# EAGLE design S77_Eggbot (EAGLE 7.7.0)
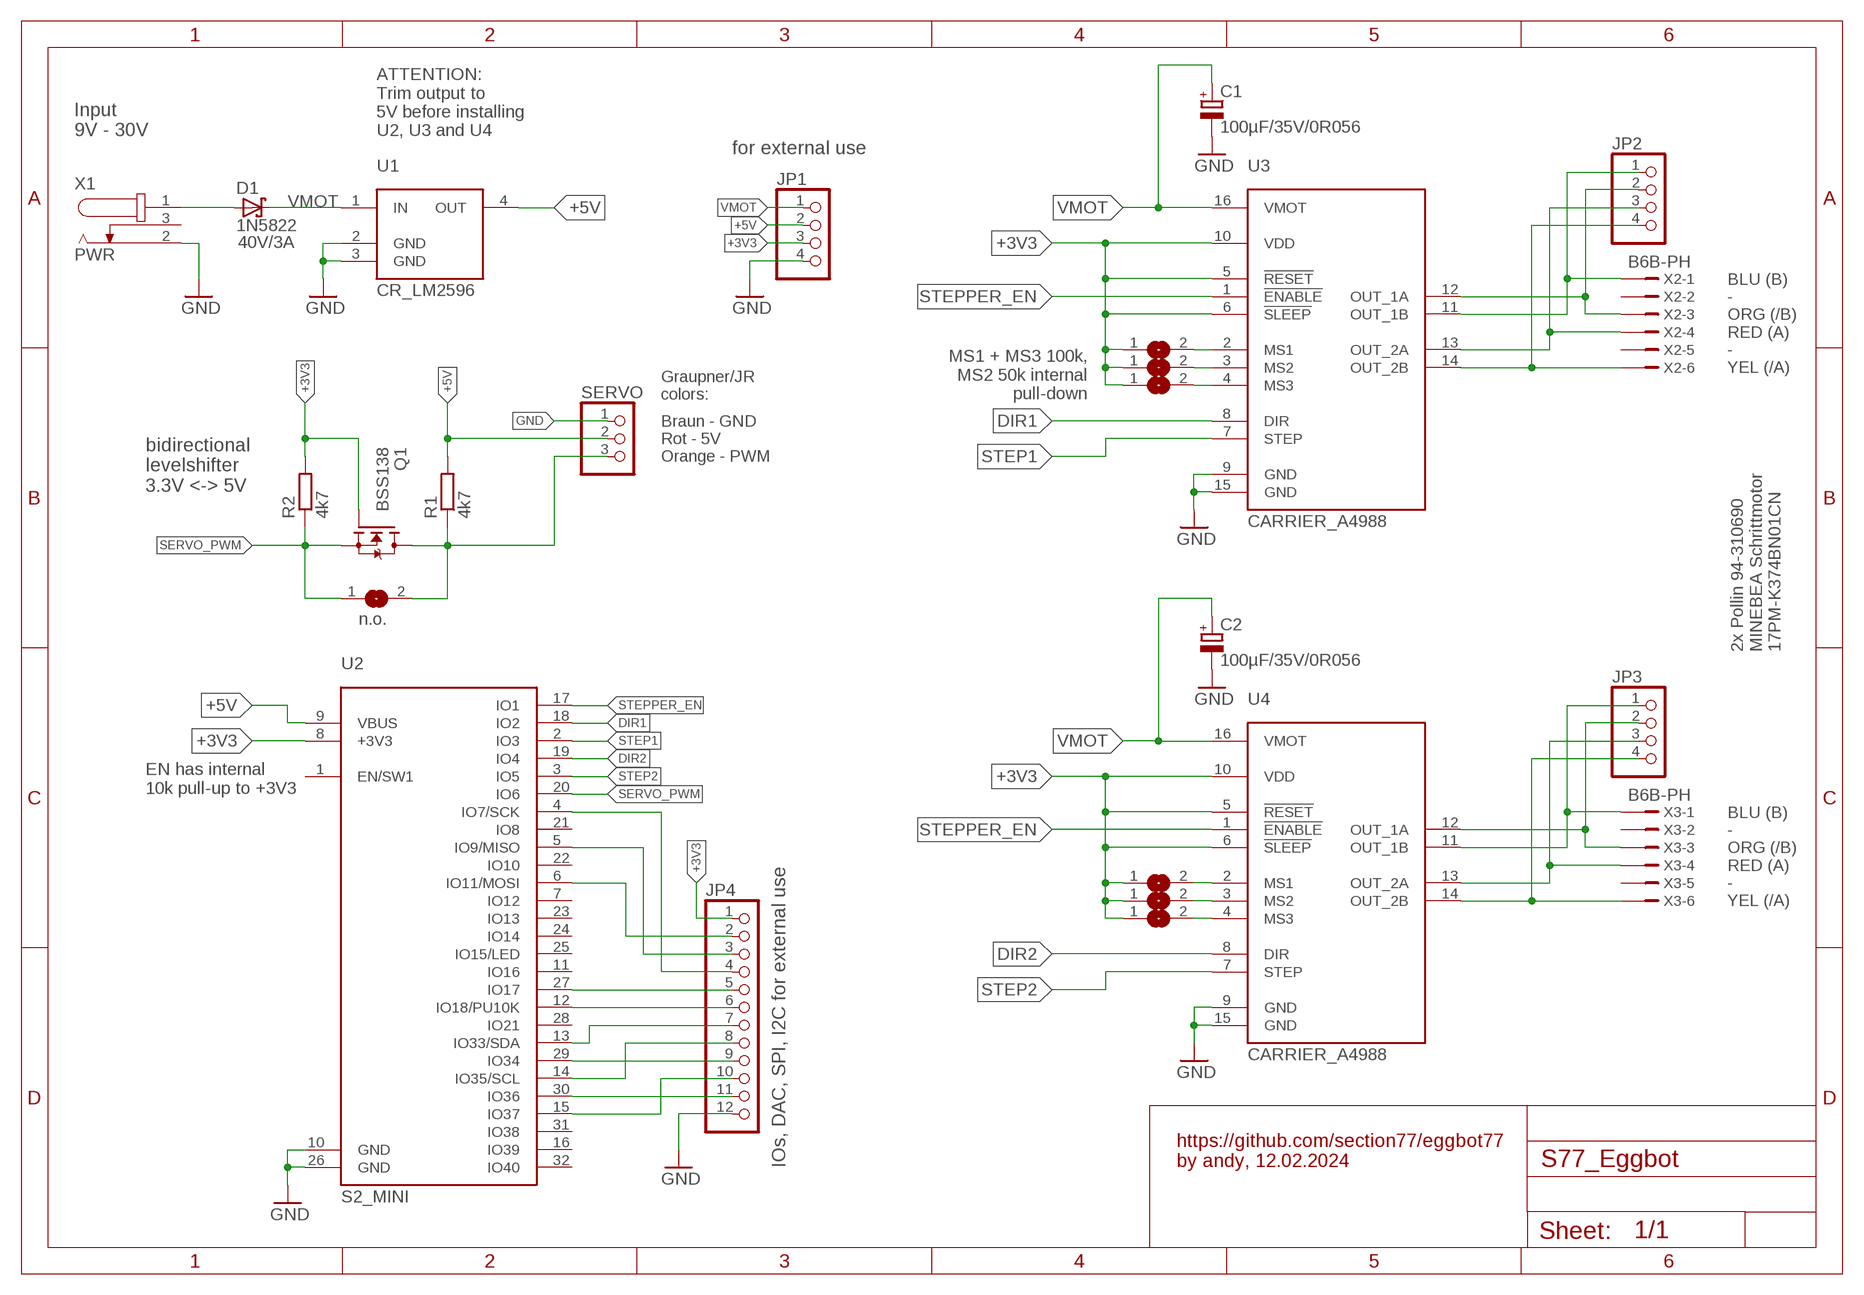
[diagram p0: schematic, sheet 1]

## Parts
C1  100µF/35V/0R056  CPOL-EUE3.5-8  [E3,5-8]
C2  100µF/35V/0R056  CPOL-EUE3.5-8  [E3,5-8]
D1  1N5822  [DO201T15]
JP1  PINHD-1X4  [1X04]
JP2  PINHD-1X4  [1X04]
JP3  PINHD-1X4  [1X04]
JP4  PINHD-1X12  [1X12]
Q1  BSS138  [SOT23]
R1  4k7  R-EU_R1206  [R1206]
R2  4k7  R-EU_R1206  [R1206]
SERVO  PINHD-1X3  [1X03]
SJ1  SJ  [SJ]
SJ2  SJ  [SJ]
SJ3  SJ  [SJ]
SJ4  SJ  [SJ]
SJ5  SJ  [SJ]
SJ6  SJ  [SJ]
SJ7  n.o.  SJ  [SJ]
U1  CR_LM2596  [CR_LM2596]
U2  S2_MINI  [S2_MINI]
U3  CARRIER_A4988  [CARRIER_A4988]
U4  CARRIER_A4988  [CARRIER_A4988]
X1  PWR  POLLIN_JACK_A  [POLLIN_JACK_A]
X2  B6B-PH  [B6B-PH]
X3  B6B-PH  [B6B-PH]

## Nets
+3V3: JP1.3 JP4.1 Q1.1(G) R2.2 SJ1.1 SJ2.1 SJ3.1 SJ4.1 SJ5.1 SJ6.1 U2.8(+3V3) U3.5(!RESET) U3.6(!SLEEP) U3.10(VDD) U4.5(!RESET) U4.6(!SLEEP) U4.10(VDD)
+5V: JP1.2 R1.2 SERVO.2 U1.4(OUT) U2.9(VBUS)
DIR1: U2.18(IO2) U3.8(DIR)
DIR2: U2.19(IO4) U4.8(DIR)
GND: C1.- C2.- JP1.4 JP4.12 SERVO.1 U1.2(GND) U1.3(GND) U2.10(GND) U2.26(GND) U3.9(GND) U3.15(GND) U4.9(GND) U4.15(GND) X1.2
N$1: Q1.3(D) R1.1 SERVO.3 SJ7.2
N$2: JP2.1 U3.11(OUT_1B) X2.1
N$3: D1.A X1.1
N$4: JP2.2 U3.12(OUT_1A) X2.3
N$5: JP2.3 U3.13(OUT_2A) X2.4
N$6: JP2.4 U3.14(OUT_2B) X2.6
N$7: JP3.1 U4.11(OUT_1B) X3.1
N$8: JP3.2 U4.12(OUT_1A) X3.3
N$9: JP3.3 U4.13(OUT_2A) X3.4
N$10: JP3.4 U4.14(OUT_2B) X3.6
N$11: SJ1.2 U3.2(MS1)
N$12: SJ2.2 U3.3(MS2)
N$13: SJ3.2 U3.4(MS3)
N$17: SJ4.2 U4.2(MS1)
N$18: SJ5.2 U4.3(MS2)
N$19: SJ6.2 U4.4(MS3)
N$20: JP4.4 U2.4(IO7/SCK)
N$21: JP4.3 U2.5(IO9/MISO)
N$22: JP4.2 U2.6(IO11/MOSI)
N$23: JP4.5 U2.27(IO17)
N$24: JP4.6 U2.12(IO18/PU10K)
N$25: JP4.7 U2.13(IO33/SDA)
N$26: JP4.9 U2.29(IO34)
N$27: JP4.8 U2.14(IO35/SCL)
N$28: JP4.11 U2.30(IO36)
N$29: JP4.10 U2.15(IO37)
SERVO_PWM: Q1.2(S) R2.1 SJ7.1 U2.20(IO6)
STEP1: U2.2(IO3) U3.7(STEP)
STEP2: U2.3(IO5) U4.7(STEP)
STEPPER_EN: U2.17(IO1) U3.1(!ENABLE) U4.1(!ENABLE)
VMOT: C1.+ C2.+ D1.C JP1.1 U1.1(IN) U3.16(VMOT) U4.16(VMOT)
Unconnected: U2.1(EN/SW1) U2.7(IO12) U2.11(IO16) U2.16(IO39) U2.21(IO8) U2.22(IO10) U2.23(IO13) U2.24(IO14) U2.25(IO15/LED) U2.28(IO21) U2.31(IO38) U2.32(IO40) X1.3 X2.2 X2.5 X3.2 X3.5

## Notes on the sheet
- Input
  9V - 30V
- ATTENTION:
  Trim output to
  5V before installing
  U2, U3 and U4
- for external use
- 40V/3A
- BLU (B)
  -
  ORG (/B)
  RED (A)
  -
  YEL (/A)
- MS1 + MS3 100k,
  MS2 50k internal
  pull-down
- Graupner/JR
  colors:
- Braun - GND
  Rot - 5V
  Orange - PWM
- bidirectional
  levelshifter
  3.3V <-> 5V
- 2x Pollin 94-310690
  MINEBEA Schrittmotor
  17PM-K374BN01CN
- EN has internal
  10k pull-up to +3V3
- BLU (B)
  -
  ORG (/B)
  RED (A)
  -
  YEL (/A)
- IOs, DAC, SPI, I2C for external use
- https://github.com/section77/eggbot77
  by andy, 12.02.2024

## Library data of the parts
C1 C2 = rcl:CPOL-EU: POLARIZED CAPACITOR, European symbol; MF: Panasonic; MPN: EEUFR1V101; OC_REICHELT: RAD FR 100/35
D1 = lib_s77_eggbot:1N5822; OC_REICHELT: 1N 5822
JP1-JP3 = pinhead:PINHD-1X4: PIN HEADER
JP4 = pinhead:PINHD-1X12: PIN HEADER
Q1 = bss138_10:BSS138: BSS138 N-Channel Logic Level Enhancement Mode Field Effect Transistor Source: http://www.fairchildsemi.com/datasheets/BS/BSS138.pdf; MF: Fairchild; MPN: BSS138; OC_FARNELL: 9845330; OC_NEWARK: 67R2009
R1 R2 = rcl:R-EU_: RESISTOR, European symbol
SERVO = pinhead:PINHD-1X3: PIN HEADER
SJ1-SJ7 = jumper:SJ: SMD solder JUMPER
U1 = lib_s77_eggbot:CR_LM2596: Zhovee ‎KKK20 board with LM2596 On Amazon: https://www.amazon.de/Stromversorgung-Spannungsregler-Abwärtswandler-Hocheffizienter-Einstellbares/dp/B07F38DJLS/
U2 = lib_s77_eggbot:S2_MINI: Based on https://www.wemos.cc/en/latest/_static/files/sch_s2_mini_v1.0.0.pdf and https://www.wemos.cc/en/latest/_static/boards/s2_mini_v1.0.0_2_16x16.jpg IO0 -> SW2 IO15 -> LED IO18->10k PullUp 3V3
U3 U4 = lib_s77_eggbot:CARRIER_A4988: A4988 carrier board based on Pololu #1182 drawings
X1 = lib_s77_eggbot:POLLIN_JACK_A: Quellen: Pollin 452 316 (5.5/2.1mm) <https://www.pollin.de/productdownloads/D452316D.PDF> Pollin 451 810 (5.5/2.5mm) <https://www.pollin.de/productdownloads/D451810D.PDF>
X2 X3 = lib_s77_eggbot:B6B-PH: JST B6B-PH

## Net classes
0 default: width 0.2 mm, drill 0.3 mm, clearance 0.15 mm

## Board
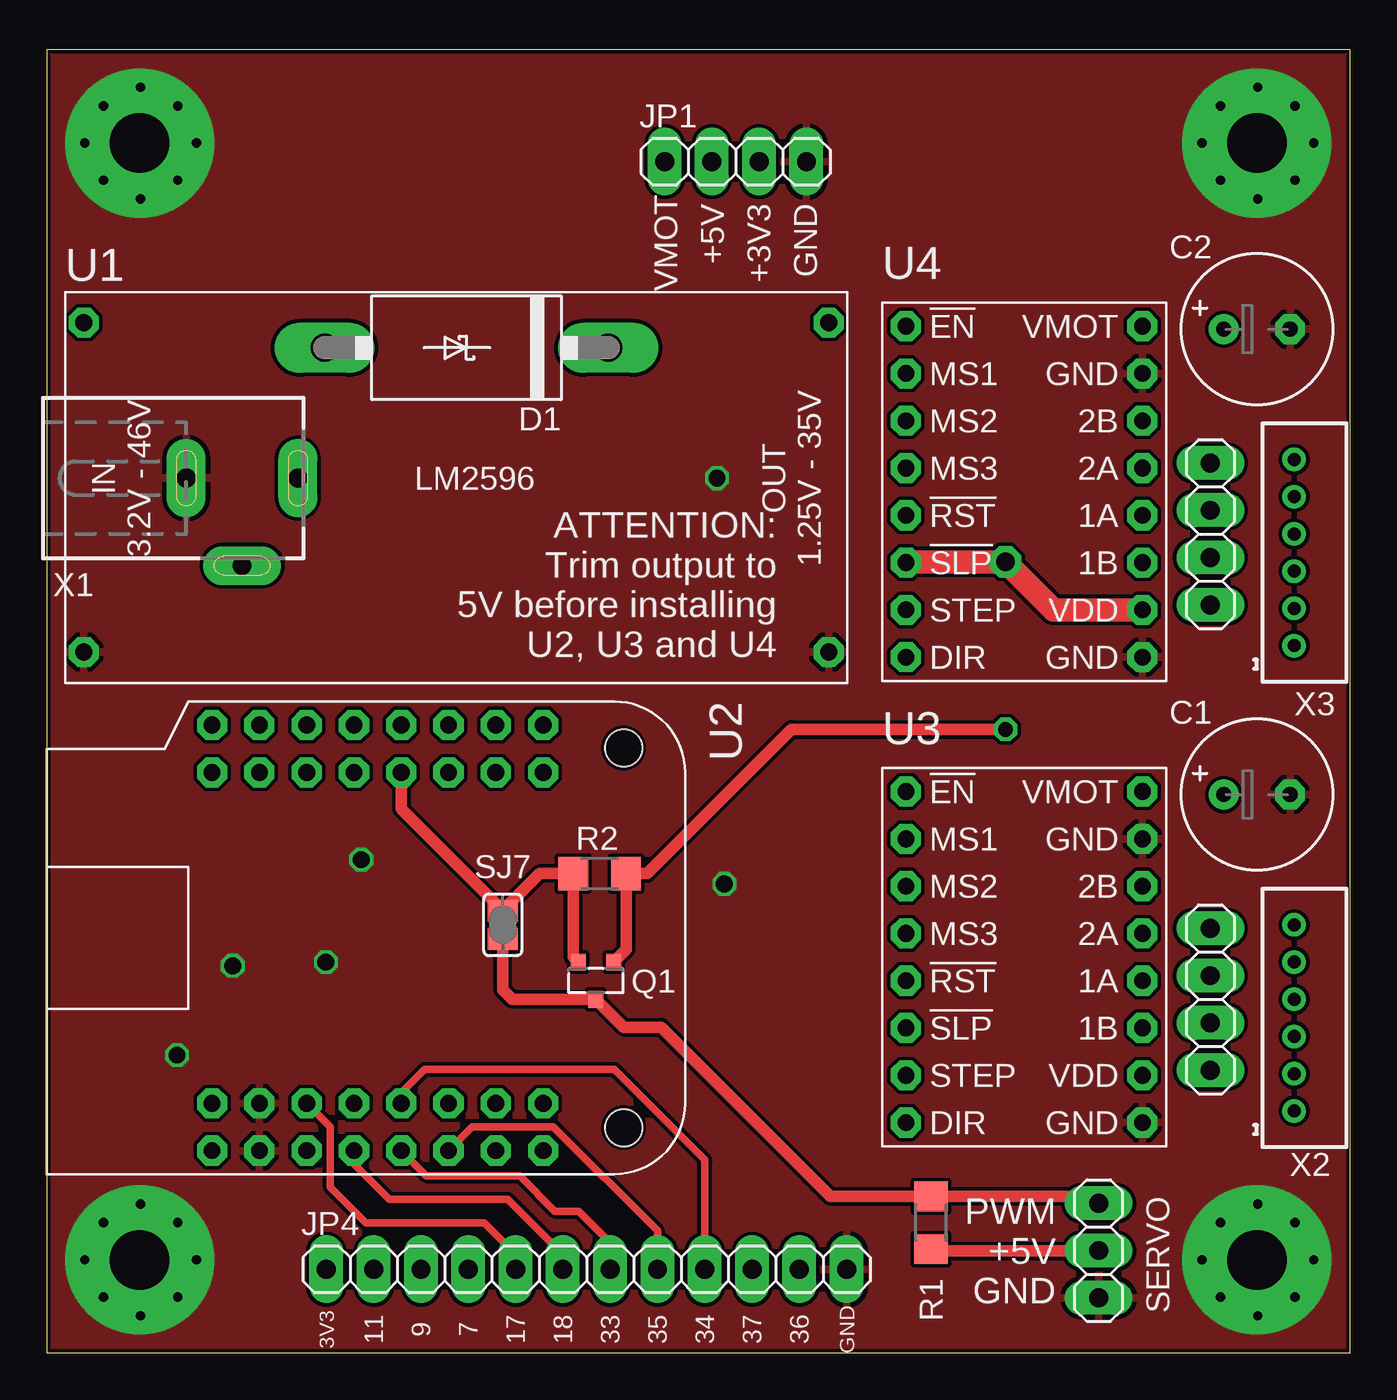
[diagram p1: board, top side]
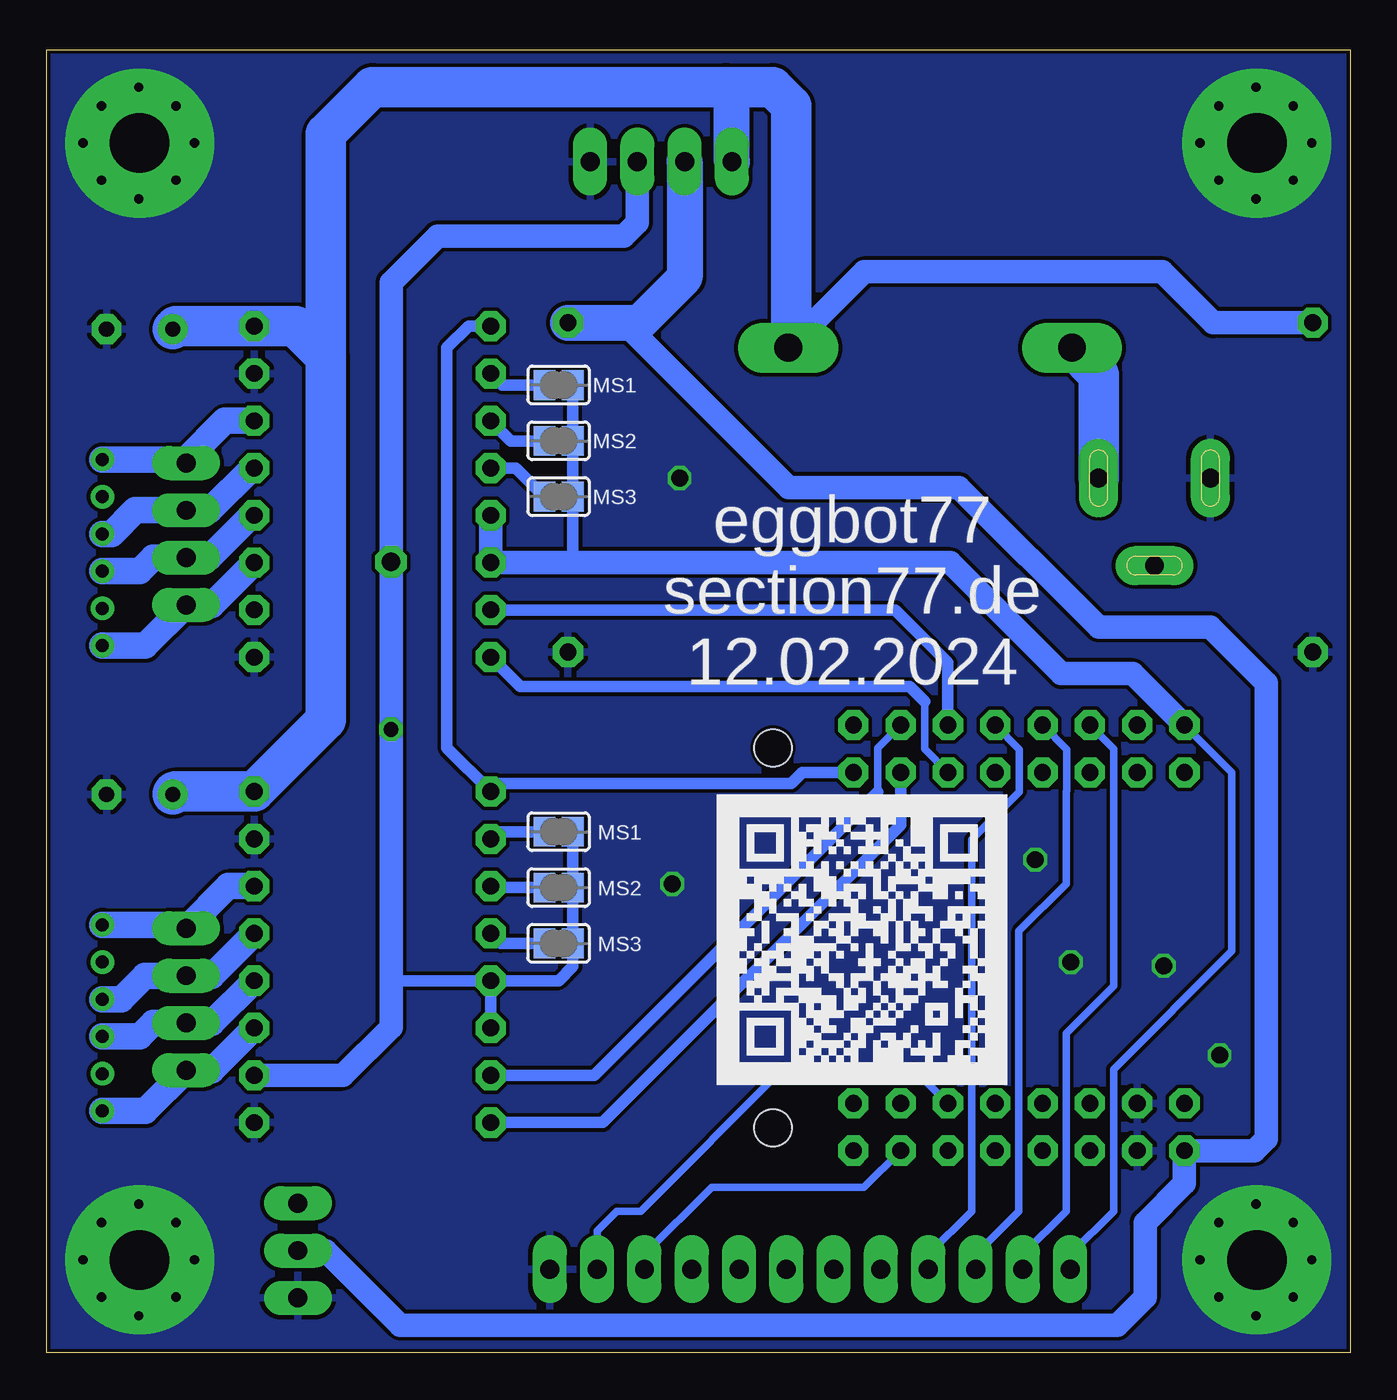
[diagram p2: board, bottom side, seen from below]

Size 70 x 70 mm. Coordinates in mm from the lower left corner, seen from the top.
Outline: 0,0 70,0 70,70 0,70 0,0
Copper layers (1*16): Top 0.035mm / dielectric 1.6mm / Bottom 0.035mm
Design rules "jlcpcb-2layers *": minimum track width 5mil, minimum drill 0.3mm, track to track 8mil, track to pad 8mil, pad to pad 8mil, via to via 8mil, smd to smd 8mil, copper to edge 0.2mm, drill to drill 6mil, minimum pad ring 10mil, minimum via ring 3mil, stop-mask expansion 4mil, vias tented up to drill 0mil, thermal gap 10mil

### Footprints (pad centres in the part's own frame; a part is rotated, then mirrored left to right if it is on the bottom)
E3,5-8 = drill 0.813 pad 1.6: + -1.778,0 | drill 0.813 pad 1.6 octagon: - 1.778,0
DO201T15 = drill 1.499 long: A 7.62,0; C -7.62,0
1X04 = drill 1.016 long: 1 -3.81,0; 2 -1.27,0; 3 1.27,0; 4 3.81,0
1X12 = drill 1.016 long: 1 -13.97,0; 2 -11.43,0; 3 -8.89,0; 4 -6.35,0; 5 -3.81,0; 6 -1.27,0; 7 1.27,0; 8 3.81,0; 9 6.35,0; 10 8.89,0; 11 11.43,0; 12 13.97,0
SOT23 = smd 0.8 x 0.9: 1 -0.95,-1; 2 0.95,-1; 3 0,1
R1206 = smd 1.6 x 1.803: 1 -1.422,0; 2 1.422,0
1X03 = drill 1.016 long: 1 -2.54,0; 2 0,0; 3 2.54,0
SJ = smd 1.168 x 1.6: 1 -0.762,0; 2 0.762,0
CR_LM2596 = drill 0.9 pad 1.422 octagon: 1 1,19.35; 2 1,1.65; 3 41,1.65; 4 41,19.35
S2_MINI = drill 0.9 octagon: 1 1.27,26.67; 2 1.27,24.13; 3 1.27,21.59; 4 1.27,19.05; 5 1.27,16.51; 6 1.27,13.97; 7 1.27,11.43; 8 1.27,8.89; 9 24.13,8.89; 10 24.13,11.43; 11 24.13,13.97; 12 24.13,16.51; 13 24.13,19.05; 14 24.13,21.59; 15 24.13,24.13; 16 24.13,26.67; 17 3.81,26.67; 18 3.81,24.13; 19 3.81,21.59; 20 3.81,19.05; 21 3.81,16.51; 22 3.81,13.97; 23 3.81,11.43; 24 3.81,8.89; 25 21.59,8.89; 26 21.59,11.43; 27 21.59,13.97; 28 21.59,16.51; 29 21.59,19.05; 30 21.59,21.59; 31 21.59,24.13; 32 21.59,26.67 | hole 2: 2.5,30.988; 22.9,30.988
CARRIER_A4988 = drill 0.9 octagon: 1 -6.35,10.16; 2 -6.35,7.62; 3 -6.35,5.08; 4 -6.35,2.54; 5 -6.35,0; 6 -6.35,-2.54; 7 -6.35,-5.08; 8 -6.35,-7.62; 9 6.35,-7.62; 10 6.35,-5.08; 11 6.35,-2.54; 12 6.35,0; 13 6.35,2.54; 14 6.35,5.08; 15 6.35,7.62; 16 6.35,10.16
POLLIN_JACK_A = drill 1 pad 2.1 long: 1 0,3; 2 0,-3; 3 4.7,0
B6B-PH = drill 0.7 pad 1.1: 1 -5,0; 2 -3,0; 3 -1,0; 4 1,0; 5 3,0; 6 5,0

### Placement (x,y rotation side)
C1  65,30 0 top
C2  65,55 0 top
D1  22.55,54 180 top
JP1  37,64 0 top
JP2  62.5,19 90 top
JP3  62.5,44 90 top
JP4  29,4.5 0 top
Q1  29.5,20 180 top
R1  47.5,7 270 top
R2  29.7,25.75 0 top
SERVO  56.5,5.5 90 top
SJ1  42.5,28 180 bottom
SJ2  42.5,25 180 bottom
SJ3  42.5,22 180 bottom
SJ4  42.5,52 180 bottom
SJ5  42.5,49 180 bottom
SJ6  42.5,46 180 bottom
SJ7  24.5,23 270 top
U1  1,36 0 top
U2  0,35 270 top
U3  52.5,20 0 top
U4  52.5,45 0 top
X1  10.5,47 270 top
X2  67,18 90 top
X3  67,43 90 top

### Tracks (layer width: path | path; a pad name or v marks a point on that pad's centre or on a via)
+3V3  (via drill 0.8 pad 1.27, 1 pad 1.68)
  Top 0.61: Q1.1 31.12,21.67 R2.2 32.25,25.75 40,33.5 v51.5,33.5
  Top 1.27: U4.10 54.08,39.92 v51.5,42.5 46.19,42.5 U4.6
  Bottom 0.406: 15.03,5.29 12.7,7.62 12.7,15.24 6.35,21.59 6.35,31.19 U2.8
  Bottom 0.61: U4.6 42.04,42.46 41.74,42.76 SJ6.1 SJ5.1 SJ4.1 | U3.5 42.5,20 41.74,20.76 SJ3.1 SJ2.1 SJ1.1 | U3.5 51.5,20 | U3.6 U3.5 | JP4.1 15.03,5.29
  Bottom 1.27: U2.8 11.66,36.5 15.5,36.5 21.46,42.46 U4.6 U4.5 | U3.10 54.08,14.92 51.5,17.5 51.5,20 v51.5,33.5 v51.5,42.5 51.5,57.5 49,60 39,60 38.27,60.73 JP1.3
+5V
  Top 0.61: R1.2 47.58,5.5 SERVO.2
  Bottom 1.27: 39,55.35 30.15,46.5 21,46.5 13.5,39 7.5,39 4.5,36 4.5,11.5 5.13,10.87 U2.9 8.89,9.11 11,7 11,3 12.5,1.5 51,1.5 55,5.5 SERVO.2
  Bottom 1.93: U1.4 39,55.35 38.15,55.35 35.73,57.77 JP1.2
DIR1
  Bottom 0.61: U3.8 40.12,12.38 24.13,28.37 U2.18
DIR2
  Bottom 0.406: U2.19 22.85,32.45 22.85,35
  Bottom 0.61: U4.8 44.57,35.8 23.65,35.8 22.85,35
GND  (via drill 0.5, 0.9 pad 1.27, 3.2 pad 8)
  other vias: 5,5 5.05,2 8.05,5 2.05,5 5.05,8 3.05,7 7.05,7 7.05,3 3.05,3 65,5 65.05,2 68.05,5 62.05,5 65.05,8 63.05,7 67.05,7 67.05,3 63.05,3 65,65 65.05,62 68.05,65 62.05,65 65.05,68 63.05,67 67.05,67 67.05,63 63.05,63 5,65 5.05,62 8.05,65 2.05,65 5.05,68 3.05,67 7.05,67 7.05,63 3.05,63 7,16 36.4,25.2 36,47 16.9,26.5 15,21 10,20.8
  pour Top: 0,0 0,70 70,70 70,0
  pour Bottom: 0,0 0,70 70,70 70,0
N$1
  Top 0.61: SERVO.3 56.12,8.42 R1.1 42.08,8.42 33,17.5 31,17.5 Q1.3 25,19 24.5,19.5 SJ7.2
N$2
  Bottom 1.422: X2.1 64.69,13 JP2.1 61.12,15.19 U3.11
N$3
  Bottom 2.184: X1.1 13.5,52.57 D1.A
N$4
  Bottom 1.422: U3.12 61.12,17.73 JP2.2 64.27,17.73 65,17 X2.3
N$5
  Bottom 1.422: X2.4 66,19 64.73,20.27 JP2.3 61.12,20.27 U3.13
N$6
  Bottom 1.422: X2.6 62.69,23 JP2.4 60.23,25.08 U3.14
N$7
  Bottom 1.422: X3.1 64.69,38 JP3.1 61.12,40.19 U4.11
N$8
  Bottom 1.422: U4.12 59,45 61.27,42.73 JP3.2 64.27,42.73 65,42 X3.3
N$9
  Bottom 1.422: U4.13 58.96,47.54 61.23,45.27 JP3.3 65.23,45.27 66.5,44 X3.4
N$10
  Bottom 1.422: U4.14 60.42,50.08 62.5,48 JP3.4 62.69,48 X3.6
N$11
  Bottom 0.61: SJ1.2 45.77,28 U3.2
N$12
  Bottom 0.61: SJ2.2 46.07,25 U3.3
N$13
  Bottom 0.61: SJ3.2 45.61,22 U3.4
N$17
  Bottom 0.61: U4.2 45.53,52 SJ4.2
N$18
  Bottom 0.61: U4.3 45.07,49 SJ5.2
N$19
  Bottom 0.61: SJ6.2 44.8,47.54 U4.4
N$20
  Bottom 0.406: U2.4 17.75,32.43 17.75,30.15 20.32,27.58 20.32,7.62 22.65,5.29 JP4.4
N$21
  Bottom 0.406: U2.5 15.2,32.42 15.2,30.2 15.24,30.16 15.24,25.21 17.78,22.67 17.78,7.62 20.11,5.29 JP4.3
N$22
  Bottom 0.406: U2.6 12.7,32.46 12.7,19.71 15.24,17.17 15.24,7.62 17.57,5.29 JP4.2
N$23
  Top 0.406: U2.27 15.24,12.14 15.24,8.89 17.14,6.99 23.5,6.99 25.19,5.29 JP4.5
N$24
  Top 0.406: U2.12 16.51,10.16 18.41,8.26 24.77,8.26 27.73,5.29 JP4.6
N$25
  Top 0.406: U2.13 20.39,9.53 25.4,9.53 27.3,7.62 28.57,7.62 30.27,5.92 JP4.7
N$26
  Top 0.406: U2.29 19.05,13.97 20.32,15.24 30.48,15.24 35.35,10.37 JP4.9
N$27
  Top 0.406: JP4.8 32.81,6.56 27.22,12.15 22.87,12.15 U2.14
N$28
  Bottom 0.406: JP4.11 40.43,6.56 39.37,7.62 38.1,7.62 30.48,15.24 23.42,15.24 U2.30
N$29
  Bottom 0.406: JP4.10 37.89,5.29 34.29,8.89 26.11,8.89 U2.15
SERVO_PWM
  Top 0.61: Q1.2 28.28,21.27 R2.1 26.49,25.75 SJ7.1 19.05,29.21 U2.20
STEP1
  Bottom 0.406: U2.2 25.35,32.51 25.35,30.15
  Bottom 0.61: 25.35,30.15 40.58,14.92 U3.7
STEP2
  Bottom 0.61: U2.3 21.59,37.09 24.42,39.92 U4.7
STEPPER_EN
  Bottom 0.61: U4.1 47.34,55.16 48.5,54 48.5,32.51 U3.1 45.71,30.6 30,30.6 29.41,31.19 U2.17
VMOT
  Bottom 1.27: U1.1 7.35,55.35 10.08,58.08 26.09,58.08 D1.C
  Bottom 1.93: JP1.1 33.19,67.69
  Bottom 2.184: 55,53.5 56.5,55 arc-90 56.66,55.16 U4.16 63.06,55.16 C2.+ | 55,53.5 55,34.01 U3.16 63.06,30.16 arc-90 C1.+ | 55,53.5 55,65.5 52.5,68 33.5,68 | 33.5,68 31,68 30,67 30,54.17 D1.C | 33.19,67.69 33.5,68

### Text on the board
tPlace: ATTENTION: / Trim output to / 5V before installing / U2, U3 and U4 | PWM / +5V / GND
tNames: VMOT | +5V | +3V3 | GND | 3V3 | 11 | 9 | 7 | 17 | 18 | 33 | 35 | 34 | 37 | 36 | GND
bNames: MS1 | MS2 | MS3 | eggbot77 / section77.de / 12.02.2024 | MS1 | MS2 | MS3